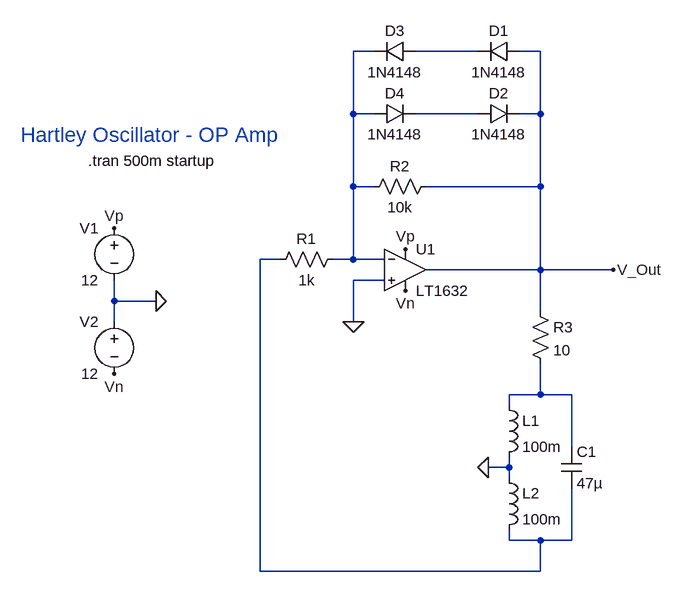
[diagram p0: schematic Hartley_Op_Amp.asc]
Hartley_Op_Amp.asc, the LTspice schematic file:
Version 4.1
SHEET 1 880 680
WIRE 192 -192 160 -192
WIRE 352 -192 256 -192
WIRE 448 -192 416 -192
WIRE 160 -96 160 -192
WIRE 192 -96 160 -96
WIRE 352 -96 256 -96
WIRE 448 -96 448 -192
WIRE 448 -96 416 -96
WIRE 160 16 160 -96
WIRE 192 16 160 16
WIRE 448 16 448 -96
WIRE 448 16 272 16
WIRE 48 128 16 128
WIRE 160 128 160 16
WIRE 160 128 128 128
WIRE 208 128 160 128
WIRE 448 144 448 16
WIRE 448 144 272 144
WIRE 560 144 448 144
WIRE 208 160 160 160
WIRE -208 192 -208 160
WIRE -144 192 -208 192
WIRE 448 208 448 144
WIRE -208 224 -208 192
WIRE 160 224 160 160
WIRE 448 336 448 288
WIRE 448 336 400 336
WIRE 496 336 448 336
WIRE 400 352 400 336
WIRE 496 416 496 336
WIRE 400 448 400 432
WIRE 400 448 368 448
WIRE 400 464 400 448
WIRE 400 560 400 544
WIRE 448 560 400 560
WIRE 496 560 496 480
WIRE 496 560 448 560
WIRE 16 608 16 128
WIRE 448 608 448 560
WIRE 448 608 16 608
FLAG -144 192 0
FLAG -208 304 Vn
FLAG 240 176 Vn
FLAG -208 80 Vp
FLAG 240 112 Vp
FLAG 560 144 V_Out
FLAG 160 224 0
FLAG 368 448 0
SYMBOL voltage -208 64 M0
WINDOW 123 0 0 Left 0
WINDOW 39 0 0 Left 0
SYMATTR InstName V1
SYMATTR Value 12
SYMBOL voltage -208 208 M0
WINDOW 123 0 0 Left 0
WINDOW 39 0 0 Left 0
SYMATTR InstName V2
SYMATTR Value 12
SYMBOL res 144 112 R90
WINDOW 0 0 56 VBottom 2
WINDOW 3 32 56 VTop 2
SYMATTR InstName R1
SYMATTR Value 1k
SYMBOL res 288 0 R90
WINDOW 0 0 56 VBottom 2
WINDOW 3 32 56 VTop 2
SYMATTR InstName R2
SYMATTR Value 10k
SYMBOL ind 384 336 R0
SYMATTR InstName L1
SYMATTR Value 100m
SYMATTR SpiceLine Rser=1m
SYMBOL ind 384 448 R0
SYMATTR InstName L2
SYMATTR Value 100m
SYMATTR SpiceLine Rser=1m
SYMBOL cap 480 416 R0
SYMATTR InstName C1
SYMATTR Value 47µ
SYMBOL res 432 192 R0
SYMATTR InstName R3
SYMATTR Value 10
SYMBOL diode 416 -208 R90
WINDOW 0 0 32 VBottom 2
WINDOW 3 32 32 VTop 2
SYMATTR InstName D1
SYMATTR Value 1N4148
SYMBOL diode 352 -80 R270
WINDOW 0 32 32 VTop 2
WINDOW 3 0 32 VBottom 2
SYMATTR InstName D2
SYMATTR Value 1N4148
SYMBOL diode 256 -208 R90
WINDOW 0 0 32 VBottom 2
WINDOW 3 32 32 VTop 2
SYMATTR InstName D3
SYMATTR Value 1N4148
SYMBOL diode 192 -80 R270
WINDOW 0 32 32 VTop 2
WINDOW 3 0 32 VBottom 2
SYMATTR InstName D4
SYMATTR Value 1N4148
SYMBOL OpAmps\\LT1632 240 80 R0
SYMATTR InstName U1
TEXT -352 -64 Left 3 ;Hartley Oscillator - OP Amp
TEXT -248 -24 Left 2 !.tran 500m startup

The netlist it stands for:
* Hartley_Op_Amp.asc
V1 Vp 0 12
V2 0 Vn 12
R1 N001 N004 1k
R2 V_Out N001 10k
L1 N005 0 100m Rser=1m
L2 0 N004 100m Rser=1m
C1 N005 N004 47µ
R3 V_Out N005 10
D1 V_Out N002 1N4148
D2 N003 V_Out 1N4148
D3 N002 N001 1N4148
D4 N001 N003 1N4148
X§U1 0 N001 Vp Vn V_Out LT1632  ; pins In+ In- V+ V- OUT
.model D D
.lib standard.dio
* Hartley Oscillator - OP Amp
.tran 500m startup
.lib LTC.lib
.backanno
.end